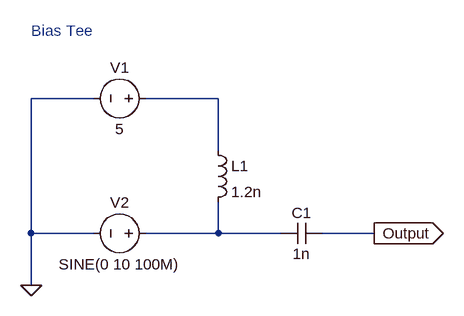
[diagram p0: schematic Bias-Tee_v0.asc]
Bias-Tee_v0.asc, the LTspice schematic file:
Version 4
SHEET 1 880 680
WIRE 32 64 -64 64
WIRE 224 64 112 64
WIRE 224 144 224 64
WIRE -64 272 -64 64
WIRE 32 272 -64 272
WIRE 224 272 224 224
WIRE 224 272 112 272
WIRE 320 272 224 272
WIRE 464 272 384 272
WIRE -64 352 -64 272
FLAG -64 352 0
FLAG 464 272 Output
IOPIN 464 272 Out
SYMBOL cap 384 256 R90
WINDOW 0 0 32 VBottom 2
WINDOW 3 32 32 VTop 2
SYMATTR InstName C1
SYMATTR Value 1n
SYMBOL ind 208 128 R0
SYMATTR InstName L1
SYMATTR Value 1.2n
SYMBOL voltage 128 272 R90
WINDOW 0 -32 56 VBottom 2
WINDOW 3 32 56 VTop 2
WINDOW 123 0 0 Left 0
WINDOW 39 0 0 Left 0
SYMATTR InstName V2
SYMATTR Value SINE(0 10 100M)
SYMBOL voltage 128 64 R90
WINDOW 0 -32 56 VBottom 2
WINDOW 3 32 56 VTop 2
WINDOW 123 0 0 Left 0
WINDOW 39 0 0 Left 0
SYMATTR InstName V1
SYMATTR Value 5
TEXT -64 -40 Left 2 ;Bias Tee

The netlist it stands for:
* Bias-Tee_v0.asc
C1 Output N002 1n
L1 N001 N002 1.2n
V2 N002 0 SINE(0 10 100M)
V1 N001 0 5
* Bias Tee
.backanno
.end